# EAGLE design Stout IEEE full dev board (EAGLE 6.3)
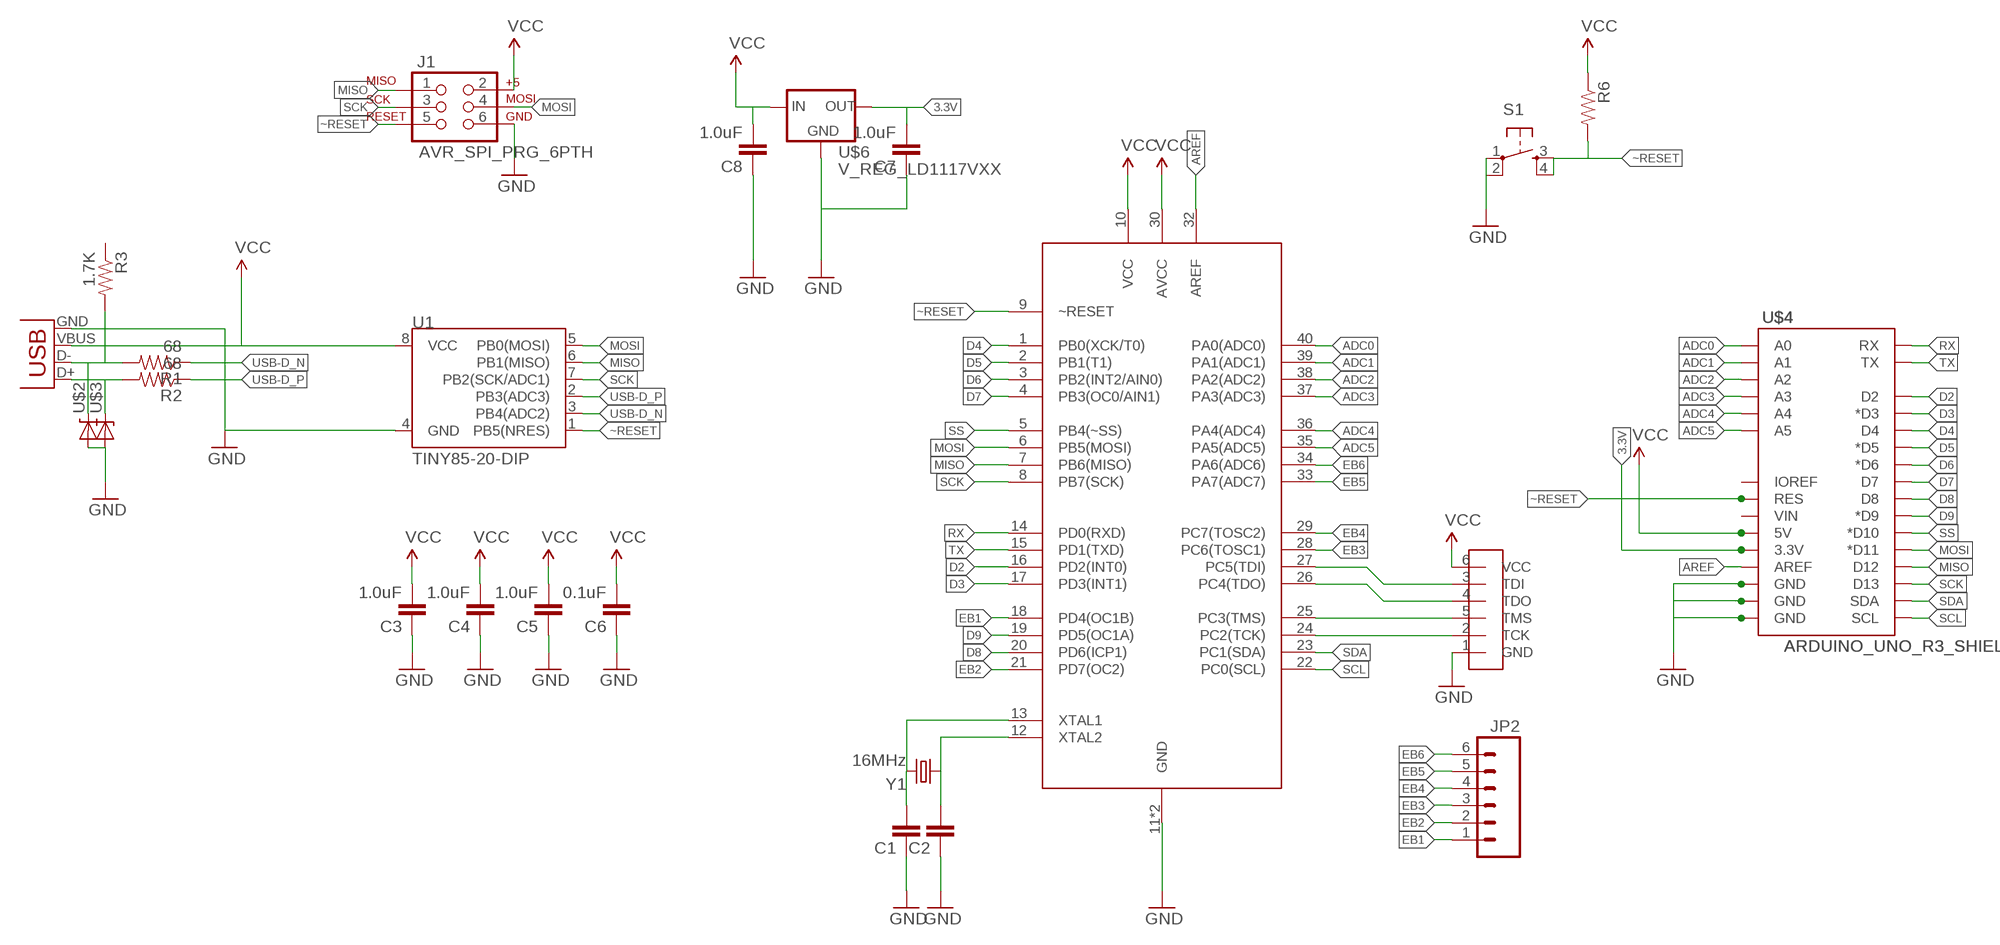
[diagram p0: schematic, sheet 1]

## Parts
C1  CAPPTH  [CAP-PTH-SMALL]
C2  CAPPTH  [CAP-PTH-SMALL]
C3  1.0uF  CAPPTH  [CAP-PTH-SMALL]
C4  1.0uF  CAPPTH  [CAP-PTH-SMALL]
C5  1.0uF  CAPPTH  [CAP-PTH-SMALL]
C6  0.1uF  CAPPTH  [CAP-PTH-SMALL]
C7  1.0uF  CAPPTH  [CAP-PTH-SMALL]
C8  1.0uF  CAPPTH  [CAP-PTH-SMALL]
J1  AVR_SPI_PRG_6PTH  [2X3]
JP1  USB-B  USBPTH  [USB-B-PTH]
JP2  M06SIP  [1X06]
R1  68  RESISTORPTH-1/4W  [AXIAL-0.4]
R2  68  RESISTORPTH-1/4W  [AXIAL-0.4]
R3  1.7K  RESISTORPTH-1/4W  [AXIAL-0.4]
R6  RESISTORPTH-1/4W  [AXIAL-0.4]
S1  TAC_SWITCHPTH  [TACTILE-PTH]
U1  TINY85-20-DIP  ATTINY45TINY85-20-DIP  [DIP08]
U$1  ATMEGA16DIP  [40-DIP]
U$2  ZENER  DIODE-ZENERPTH  [DIODE-ZENER]
U$3  ZENER  DIODE-ZENERPTH  [DIODE-ZENER]
U$4  ARDUINO_UNO_R3_SHIELD  [ARDUINO_UNO_R3_SHIELD]
U$5  JTAG  [JTAG-FPC]
U$6  V_REG_LD1117VXX  [78XXL]
Y1  16MHz  CRYSTALHC49US  [HC49US]

## Nets
3.3V: C7.2 U$4.3.3V U$6.GND(OUT)
ADC0: U$1.40(PA0(ADC0)) U$4.A0
ADC1: U$1.39(PA1(ADC1)) U$4.A1
ADC2: U$1.38(PA2(ADC2)) U$4.A2
ADC3: U$1.37(PA3(ADC3)) U$4.A3
ADC4: U$1.36(PA4(ADC4)) U$4.A4
ADC5: U$1.35(PA5(ADC5)) U$4.A5
AREF: U$1.32(AREF) U$4.AREF
D2: U$1.16(PD2(INT0)) U$4.D2
D3: U$1.17(PD3(INT1)) U$4.D3(*D3)
D4: U$1.1(PB0(XCK/T0)) U$4.D4
D5: U$1.2(PB1(T1)) U$4.D5(*D5)
D6: U$1.3(PB2(INT2/AIN0)) U$4.D6(*D6)
D7: U$1.4(PB3(OC0/AIN1)) U$4.D7
D8: U$1.20(PD6(ICP1)) U$4.D8
D9: U$1.19(PD5(OC1A)) U$4.D9(*D9)
EB1: JP2.1 U$1.18(PD4(OC1B))
EB2: JP2.2 U$1.21(PD7(OC2))
EB3: JP2.3 U$1.28(PC6(TOSC1))
EB4: JP2.4 U$1.29(PC7(TOSC2))
EB5: JP2.5 U$1.33(PA7(ADC7))
EB6: JP2.6 U$1.34(PA6(ADC6))
GND: C1.1 C2.1 C3.1 C4.1 C5.1 C6.1 C7.1 C8.1 J1.6 JP1.GND S1.1 S1.2 U1.4(GND) U$1.11(GND) U$1.31(GND) U$2.P$2(A) U$3.P$2(A) U$4.GND@0(GND) U$4.GND@1(GND) U$4.GND@2(GND) U$5.1(GND) U$6.IN(GND)
MISO: J1.1 U1.6(PB1(MISO)) U$1.7(PB6(MISO)) U$4.D12
MOSI: J1.4 U1.5(PB0(MOSI)) U$1.6(PB5(MOSI)) U$4.D11(*D11)
N$1: C2.2 U$1.12(XTAL2) Y1.1
N$2: C1.2 U$1.13(XTAL1) Y1.2
N$4: JP1.D- R1.P$2 R3.P$2 U$2.P$1(C)
N$5: JP1.D+ R2.P$2 U$3.P$1(C)
N$8: U$1.24(PC2(TCK)) U$5.2(TCK)
N$10: U$1.25(PC3(TMS)) U$5.5(TMS)
N$11: U$1.26(PC4(TDO)) U$5.4(TDO)
N$12: U$1.27(PC5(TDI)) U$5.3(TDI)
RX: U$1.14(PD0(RXD)) U$4.RX
SCK: J1.3 U1.7(PB2(SCK/ADC1)) U$1.8(PB7(SCK)) U$4.D13
SCL: U$1.22(PC0(SCL)) U$4.SCL
SDA: U$1.23(PC1(SDA)) U$4.SDA
SS: U$1.5(PB4(~SS)) U$4.D10(*D10)
TX: U$1.15(PD1(TXD)) U$4.TX
USB-D_N: R1.P$1 U1.3(PB4(ADC2))
USB-D_P: R2.P$1 U1.2(PB3(ADC3))
VCC: C3.2 C4.2 C5.2 C6.2 C8.2 J1.2 JP1.VBUS R6.P$1 U1.8(VCC) U$1.10(VCC) U$1.30(AVCC) U$4.5V U$5.6(VCC) U$6.OUT(IN)
~RESET: J1.5 R6.P$2 S1.3 S1.4 U1.1(PB5(NRES)) U$1.9(~RESET) U$4.RES
Unconnected: R3.P$1 U$4.IOREF U$4.VIN

## Library data of the parts
C1-C8 = SparkFun-Capacitors:CAP: Capacitor Standard 0603 ceramic capacitor, and 0.1" leaded capacitor.
J1 = SparkFun-Connectors:AVR_SPI_PRG_6: AVR ISP 6 Pin This is the reduced ISP connector for AVR programming. Common on Arduino. This footprint will take up less PCB space and can be used with a 10-pin to 6-pin adapter such as SKU: BOB-08508
JP1 = SparkFun-Connectors:USB: USB Connectors USB-B-PTH is fully proven SKU : PRT-00139/CONN-08278 USB-miniB is fully proven SKU : PRT-00587 USB-A-PCB is untested. USB-A-H is throughly reviewed, but untested. Spark Fun Electronics SKU : PRT-00437 USB-B-SMT is throughly reviewed, but untested. Needs silkscreen touching up. USB-A-S has not been used/tested USB-MB-H has not been used/tested USB-MICROB has been used. CONN-09505; PROD_ID: CONN-08278
JP2 = SparkFun-Connectors:M06: Header 6 Standard 6-pin 0.1" header. Use with straight break away headers (SKU : PRT-00116), right angle break away headers (PRT-00553), swiss pins (PRT-00743), machine pins (PRT-00117), and female headers (PRT-00115). Molex polarized connector foot print use with SKU : PRT-08094 with associated crimp pins and housings. NOTES ON THE VARIANTS LOCK and LOCK_LONGPADS... This footprint was designed to help hold the alignment of a through-hole component (i.e. 6-pin header) while soldering it into place. You may notice that each hole has been shifted either up or down by 0.005 of an inch from it's more standard position (which is a perfectly straight line). This slight alteration caused the pins (the squares in the middle) to touch the edges of the holes. Because they are alternating, it causes a "brace" to hold the component in place. 0.005 has proven to be the perfect amount of "off-center" position when using our standard breakaway headers. Although looks a little odd when you look at the bare footprint, once you have a header in there, the alteration is very hard to notice. Also,if you push a header all the way into place, it is covered up entirely on the bottom side. This idea of altering the position of holes to aid alignment will be further integrated into the Sparkfun Library for other footprints. It can help hold any component with 3 or more connection pins.
R1-R3 R6 = SparkFun-Resistors:RESISTOR: Resistor Basic schematic elements and footprints for 0603, 1206, and PTH resistors.
S1 = SparkFun-Electromechanical:TAC_SWITCH: Momentary Switch Button commonly used for reset or general input. Spark Fun Electronics SKU : COM-00097 SMT- SWCH-08247
U1 = SparkFun-DigitalIC:ATTINY45: Atmel 8-pin 2/4/8kB flash uC; PROD_ID: IC-09445
U$1 = Strutz Electronic Industries:ATMEGA16
U$2 U$3 = SparkFun-DiscreteSemi:DIODE-ZENER: Zener Diode Production Part - 8199 3.4V Zener Voltage
U$4 = Strutz Electronic Industries:ARDUINO_UNO_R3_SHIELD
U$5 = Strutz Electronic Industries:JTAG
U$6 = SparkFun-PowerIC:V_REG_LD1117VXX: LD1117VXX voltage regulator. We carry the 3.3V version (COM-00526) in TO-220 package.
Y1 = SparkFun-FreqCtrl:CRYSTAL: Various standard crystals. Proven footprints. Spark Fun Electronics SKU : COM-00534

## Board
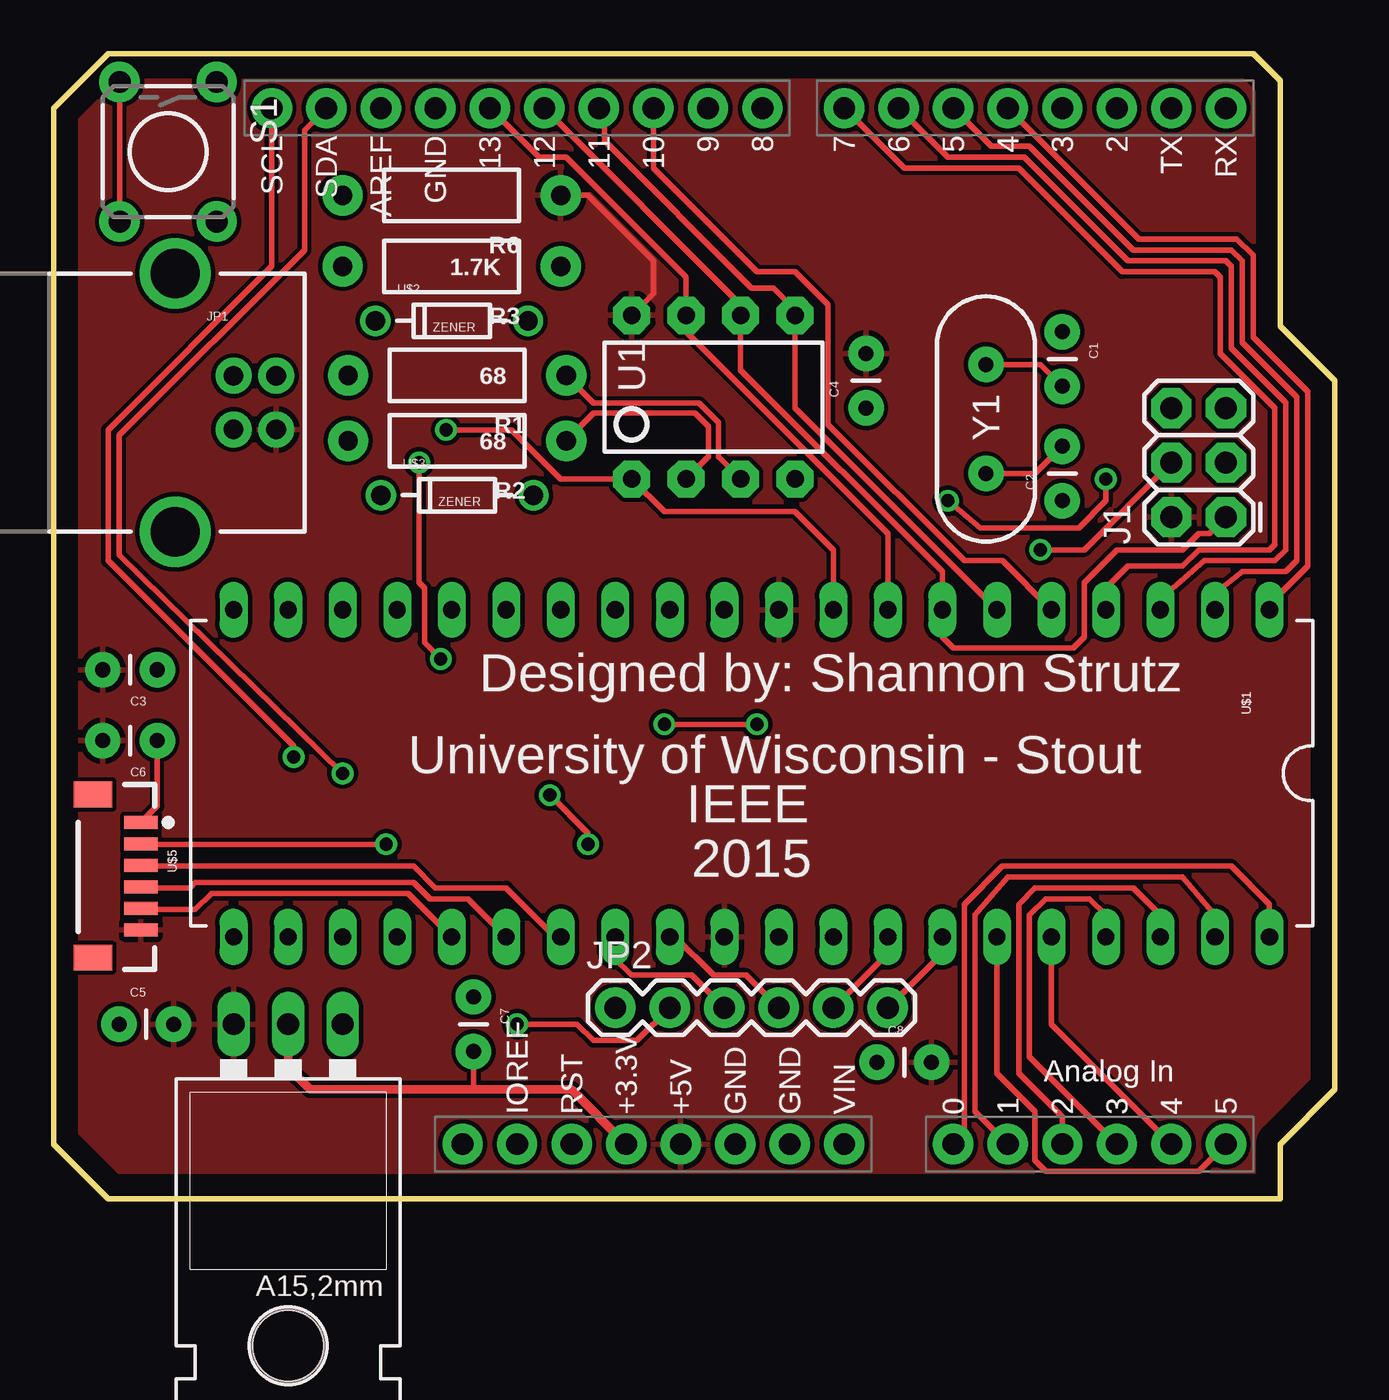
[diagram p1: board, top side]
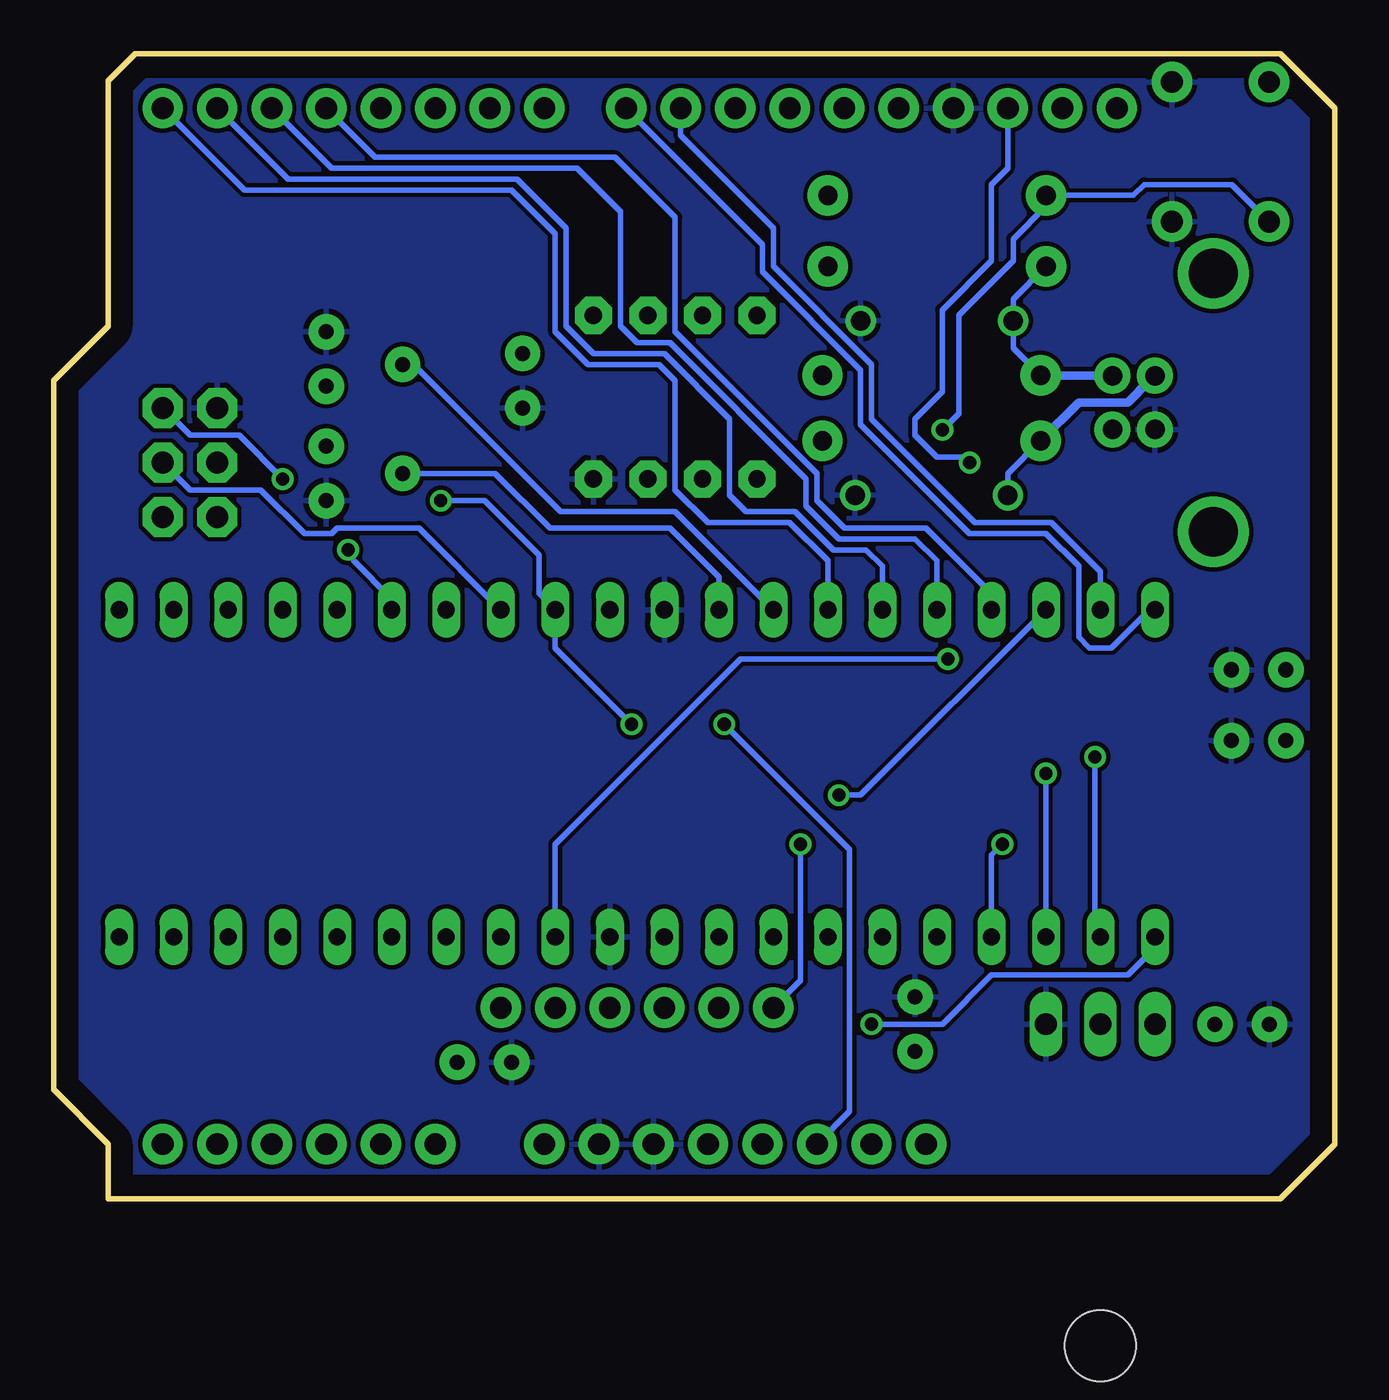
[diagram p2: board, bottom side, seen from below]

Size 59.69 x 53.34 mm. Coordinates in mm from the lower left corner, seen from the top.
Outline: 2.54,0 0,2.54 0,50.8 2.54,53.34 55.88,53.34 57.15,52.07 57.15,40.64 59.69,38.1 59.69,5.08 57.15,2.54 57.15,0 2.54,0
Copper layers (1*16): Top 0.035mm / dielectric 1.5mm / Bottom 0.035mm
Design rules "default": minimum track width 10mil, minimum drill 24mil, track to track 8mil, track to pad 8mil, pad to pad 8mil, via to via 8mil, smd to smd 8mil, copper to edge 40mil, drill to drill 8mil, minimum pad ring 10mil, minimum via ring 8mil, stop-mask expansion 4mil, vias tented up to drill 0mil, thermal gap 10mil

### Footprints (pad centres in the part's own frame; a part is rotated, then mirrored left to right if it is on the bottom)
CAP-PTH-SMALL = drill 0.7 pad 1.651: 1 0,0; 2 2.54,0
2X3 = drill 1.016 pad 1.88 octagon: 1 0,0; 2 0,2.54; 3 2.54,0; 4 2.54,2.54; 5 5.08,0; 6 5.08,2.54
USB-B-PTH = drill 0.914 pad 1.676: D+ 0,1.25; D- 1.981,1.25; GND 0,-1.25; VBUS 1.981,-1.25 | drill 2.286: S1 -2.718,-6.02; S2 -2.718,6.02
1X06 = drill 1.016 pad 1.88: 1 0,0; 2 2.54,0; 3 5.08,0; 4 7.62,0; 5 10.16,0; 6 12.7,0
AXIAL-0.4 = drill 0.9 pad 1.88: P$1 -5.08,0; P$2 5.08,0
TACTILE-PTH = drill 1.016 pad 1.88: 1 -3.251,2.261; 2 3.251,2.261; 3 -3.251,-2.261; 4 3.251,-2.261
DIP08 = drill 0.813 pad 1.727 octagon: 1 -3.81,-3.81; 2 -1.27,-3.81; 3 1.27,-3.81; 4 3.81,-3.81; 5 3.81,3.81; 6 1.27,3.81; 7 -1.27,3.81; 8 -3.81,3.81
40-DIP = drill 0.8 long: 1 -7.62,24.13; 2 -7.62,21.59; 3 -7.62,19.05; 4 -7.62,16.51; 5 -7.62,13.97; 6 -7.62,11.43; 7 -7.62,8.89; 8 -7.62,6.35; 9 -7.62,3.81; 10 -7.62,1.27; 11 -7.62,-1.27; 12 -7.62,-3.81; 13 -7.62,-6.35; 14 -7.62,-8.89; 15 -7.62,-11.43; 16 -7.62,-13.97; 17 -7.62,-16.51; 18 -7.62,-19.05; 19 -7.62,-21.59; 20 -7.62,-24.13; 21 7.62,-24.13; 22 7.62,-21.59; 23 7.62,-19.05; 24 7.62,-16.51; 25 7.62,-13.97; 26 7.62,-11.43; 27 7.62,-8.89; 28 7.62,-6.35; 29 7.62,-3.81; 30 7.62,-1.27; 31 7.62,1.27; 32 7.62,3.81; 33 7.62,6.35; 34 7.62,8.89; 35 7.62,11.43; 36 7.62,13.97; 37 7.62,16.51; 38 7.62,19.05; 39 7.62,21.59; 40 7.62,24.13
DIODE-ZENER = drill 0.9: P$1 -3.556,0; P$2 3.556,0
ARDUINO_UNO_R3_SHIELD = drill 1.016 pad 1.88: 3.3V 24.13,1.27; 5V 24.13,3.81; A0 24.13,16.51; A1 24.13,19.05; A2 24.13,21.59; A3 24.13,24.13; A4 24.13,26.67; A5 24.13,29.21; AREF -24.13,-10.16; D2 -24.13,24.13; D3 -24.13,21.59; D4 -24.13,19.05; D5 -24.13,16.51; D6 -24.13,13.97; D7 -24.13,11.43; D8 -24.13,7.62; D9 -24.13,5.08; D10 -24.13,2.54; D11 -24.13,0; D12 -24.13,-2.54; D13 -24.13,-5.08; GND@0 24.13,6.35; GND@1 24.13,8.89; GND@2 -24.13,-7.62; IOREF 24.13,-3.81; NC 24.13,-6.35; RES 24.13,-1.27; RX -24.13,29.21; SCL -24.13,-15.24; SDA -24.13,-12.7; TX -24.13,26.67; VIN 24.13,11.43
JTAG-FPC = smd 0.6 x 1.55: 1 -2.54,1.27; 2 -1.54,1.27; 3 -0.54,1.27; 4 0.46,1.27; 5 1.46,1.27; 6 2.46,1.27 | smd 1.2 x 1.8: P$1 -3.84,-0.955; P$2 3.76,-0.955
78XXL = drill 1.016 long: GND 0,-3.81; IN -2.54,-3.81; OUT 2.54,-3.81 | hole 3.302: 0,11.176
HC49US = drill 0.7 pad 1.651: 1 -2.54,0; 2 2.54,0

### Placement (x,y rotation side)
C1  46.99,40.39 270 top
C2  46.99,32.51 90 top
C3  4.83,24.64 180 top
C4  37.85,36.83 90 top
C5  3.05,8.13 0 top
C6  4.83,21.34 180 top
C7  19.56,9.4 270 top
C8  38.35,6.35 0 top
J1  54.61,31.75 90 top
JP1  8.38,37.08 0 top
JP2  26.16,8.89 0 top
R1  18.8,38.35 180 top
R2  18.8,35.31 180 top
R3  18.54,43.43 180 top
R6  18.54,46.74 180 top
S1  5.33,48.77 270 top
U1  30.73,37.34 0 top
U$1  32.51,19.81 270 top
U$2  18.54,40.89 0 top
U$3  18.8,32.77 0 top
U$4  25.4,26.67 270 top
U$5  2.79,14.99 270 top
U$6  10.92,4.32 180 top
Y1  43.43,36.32 90 top

### Tracks (layer width: path | path; a pad name or v marks a point on that pad's centre or on a via)
3.3V
  Top 0.254: C7.2 19.56,5.08
  Top 0.406: U$6.GND 10.92,6.1 11.94,5.08 19.56,5.08 24.13,5.08 U$4.3.3V
ADC0
  Top 0.254: U$1.40 56.64,13.72 54.86,15.49 44.2,15.49 42.42,13.72 42.42,3.05 U$4.A0
ADC1
  Top 0.254: U$1.39 54.1,13.21 52.58,14.99 44.45,14.99 42.93,13.21 42.93,4.06 U$4.A1
ADC2
  Top 0.254: U$1.38 51.56,13.21 50.29,14.48 45.72,14.48 44.96,13.72 44.96,5.84 46.99,3.81 U$4.A2
ADC3
  Top 0.254: U$1.37 49.02,13.21 48.26,13.97 46.23,13.97 45.47,13.21 45.47,6.6 U$4.A3
ADC4
  Top 0.254: U$1.36 46.48,8.13 U$4.A4
ADC5
  Top 0.254: U$1.35 43.94,5.84 45.72,4.06 45.72,1.78 46.23,1.27 53.34,1.27 U$4.A5
AREF  (via drill 0.61 pad 0.25)
  Top 0.254: v17.02,34.29 17.02,28.7 17.27,28.45 17.27,25.91 v18.03,25.15
  Bottom 0.254: U$4.AREF 15.24,48.01 16,47.24 16,43.69 18.29,41.4 18.29,37.59 19.56,36.32 19.56,35.56 18.54,34.54 17.27,34.54 v17.02,34.29 | v18.03,25.15 27.69,25.15 36.32,16.51 U$1.32
D2
  Bottom 0.254: U$1.16 18.54,29.72 19.56,30.73 23.11,30.73 24.64,32.26 24.64,33.53 30.99,39.88 32.51,39.88 33.27,40.64 33.27,45.97 35.31,48.01 46.74,48.01 U$4.D2
D3
  Bottom 0.254: U$1.17 16,28.19 19.05,31.24 22.86,31.24 24.13,32.51 24.13,33.78 30.73,40.39 30.73,45.72 33.53,48.51 44.7,48.51 U$4.D3
D4
  Top 0.254: U$1.1 56.64,27.69 58.42,29.46 58.42,37.59 55.88,40.13 55.88,43.94 55.12,44.7 50.55,44.7 U$4.D4
D5
  Top 0.254: U$1.2 54.1,28.19 55.37,29.21 57.4,29.21 57.91,29.72 57.91,37.34 55.37,39.88 55.37,43.69 54.86,44.2 50.29,44.2 45.47,49.02 43.69,49.02 U$4.D5
D6
  Top 0.254: U$1.3 51.56,27.94 53.59,29.72 56.9,29.72 57.4,30.23 57.4,37.08 54.86,39.62 54.86,43.43 54.61,43.69 50.04,43.69 45.21,48.51 41.66,48.51 U$4.D6
D7
  Top 0.254: U$1.4 49.02,28.45 50.04,29.46 52.58,29.46 53.34,30.23 56.64,30.23 56.9,30.48 56.9,36.83 54.36,39.37 54.36,42.93 54.1,43.18 49.78,43.18 44.96,48.01 39.62,48.01 U$4.D7
D8
  Bottom 0.254: U$1.20 8.64,27.43 10.41,25.65 11.43,25.65 11.94,26.16 11.94,29.46 13.46,30.99 17.02,30.99 22.1,36.07 22.1,38.61 26.67,43.18 26.67,44.45 U$4.D8
D9
  Bottom 0.254: U$1.19 10.92,29.21 13.21,31.5 16.76,31.5 21.59,36.32 21.59,38.86 26.16,43.43 26.16,45.21 30.48,49.53 U$4.D9
EB1  (via drill 0.61 pad 0.25)
  Top 0.254: v23.11,18.8 24.89,17.02 v24.89,16.51
  Bottom 0.254: U$1.18 22.1,18.8 v23.11,18.8 | v24.89,16.51 24.89,10.16 JP2.1
EB2  (via drill 0.61 pad 0.25)
  Top 0.254: v21.59,8.13 24.38,8.13 25.15,7.37 27.18,7.37 JP2.2
  Bottom 0.254: U$1.21 8.38,11.68 9.65,10.41 16,10.41 18.29,8.13 v21.59,8.13
EB3
  Top 0.254: JP2.3 29.72,10.41 26.92,10.41 26.16,11.18 U$1.28
EB4
  Top 0.254: JP2.4 32.26,10.41 30.73,10.41 28.96,12.19 U$1.29
EB5
  Top 0.254: JP2.5 38.86,11.43 U$1.33
EB6
  Top 0.254: JP2.6 41.4,11.43 U$1.34
GND
  Top 0.254: U$5.1 4.83,18.29 C6.1
  pour Bottom: -1.52,-1.02 62.23,-1.02 61.72,53.34 -2.03,53.34
MISO
  Top 0.254: U$4.D12 32,41.66 U1.6 32,38.61 41.4,29.21 U$1.7 41.4,26.16 41.91,25.65 47.5,25.65 48.01,26.16 48.01,28.7 49.53,30.23 52.58,30.23 53.34,30.99 53.85,30.99 J1.1
MOSI  (via drill 0.61 pad 0.25)
  Top 0.254: U$1.6 34.54,36.83 U1.5 34.54,41.4 33.53,42.42 32.51,42.42 25.65,49.28 25.65,50.55 U$4.D11 | v45.97,30.23 48.01,30.23 J1.4
  Bottom 0.254: U$1.6 43.94,27.94 45.72,29.72 v45.97,30.23
N$1
  Top 0.254: Y1.1 45.72,33.78 C2.2
  Bottom 0.254: U$1.12 28.7,28.96 30.99,31.24 36.58,31.24 39.12,33.78 Y1.1
N$2
  Top 0.254: Y1.2 45.97,38.86 C1.2
  Bottom 0.254: Y1.2 42.93,38.86 36.07,32 30.73,32 U$1.13
N$4
  Bottom 0.254: R1.P$2 14.99,39.62 U$2.P$1 14.99,41.91 R3.P$2
  Bottom 0.406: JP1.D- 13.72,38.33 R1.P$2
N$5
  Bottom 0.254: R2.P$2 15.24,33.78 U$3.P$1
  Bottom 0.406: JP1.D+ 8.64,38.1 9.65,37.08 11.94,37.08 R2.P$2
N$8  (via drill 0.61 pad 0.25)
  Top 0.254: U$5.2 4.08,16.51 v15.49,16.51
  Bottom 0.254: v15.49,16.51 16,16 U$1.24
N$10
  Top 0.254: U$5.5 4.13,13.46 6.6,13.46 7.37,14.22 16.51,14.22 U$1.25
N$11
  Top 0.254: U$5.4 4.11,14.48 6.35,14.48 6.6,14.73 16.76,14.73 17.53,13.97 19.3,13.97 U$1.26
N$12
  Top 0.254: U$5.3 4.35,15.49 16.76,15.49 17.78,14.48 21.08,14.48 23.37,12.19 U$1.27
RX
  Bottom 0.254: U$1.14 23.62,29.72 25.4,31.5 29.21,31.5 30.73,33.02 30.73,38.1 31.5,38.86 34.8,38.86 36.32,40.39 36.32,44.96 38.35,46.99 50.8,46.99 U$4.RX
SCK
  Top 0.254: U$1.8 38.86,30.99 29.46,40.39 U1.7 29.46,42.93 23.88,48.51 22.61,48.51 U$4.D13
  Bottom 0.254: J1.3 53.34,33.02 50.04,33.02 48.01,30.99 46.74,30.99 46.48,31.24 42.67,31.24 U$1.8
SCL  (via drill 0.61 pad 0.25)
  Top 0.254: U$4.SCL 10.16,43.43 2.54,35.81 2.54,29.72 11.18,21.08 v11.18,20.57
  Bottom 0.254: U$1.22 11.18,12.45 v11.18,20.57
SDA  (via drill 0.61 pad 0.25)
  Top 0.254: v13.46,19.81 3.05,29.97 3.05,35.56 11.68,44.2 11.68,49.78 U$4.SDA
  Bottom 0.254: U$1.23 v13.46,19.81
SS
  Top 0.254: U$4.D10 27.94,48.01 32.77,43.18 34.54,43.18 36.07,41.66 36.07,36.07 42.42,29.72 44.2,29.72 U$1.5
TX
  Bottom 0.254: U$1.15 21.08,29.46 21.84,30.23 23.37,30.23 25.15,32 27.43,32 28.19,32.77 28.19,36.32 31.24,39.37 34.54,39.37 35.81,40.64 35.81,45.21 38.1,47.5 48.77,47.5 U$4.TX
USB-D_N
  Top 0.254: R1.P$1 23.88,38.33 25.15,37.06 30.07,37.06 30.96,36.16 30.96,34.54 30.99,34.54 U1.3
USB-D_P
  Top 0.254: R2.P$1 23.88,35.33 25.15,36.6 29.88,36.6 30.51,35.97 30.51,34.54 30.48,34.54 U1.2
VCC
  Top 0.254: R6.P$1 24.89,46.74 27.94,43.69 27.94,42.16 U1.8
  pour Top: -1.02,-0.76 -1.02,54.86 61.98,54.86 61.98,-0.76
~RESET  (via drill 0.61 pad 0.25)
  Top 0.254: U$1.9 36.32,30.23 34.54,32 28.45,32 U1.1 23.62,33.53 21.34,35.81 v18.29,35.81 | S1.4 S1.3 | v49.02,33.53 49.02,32.51 47.75,31.24 43.18,31.24 v41.66,32.51 | v32.77,22.1 v28.45,22.1
  Bottom 0.254: S1.4 4.8,47.24 8.89,47.24 9.4,46.74 R6.P$2 13.46,46.23 14.99,44.7 14.99,43.69 17.53,41.15 17.53,36.58 v18.29,35.81 | J1.5 53.34,35.56 51.05,35.56 v49.02,33.53 | v41.66,32.51 39.62,32.51 37.08,29.97 37.08,28.19 U$1.9 36.32,25.65 v32.77,22.1 | v28.45,22.1 22.61,16.26 22.61,4.06 U$4.RES

### Text on the board
_tsilk: Designed by: Shannon Strutz | University of Wisconsin - Stout | IEEE | 2015